# EAGLE design 433MHz-Sender (EAGLE 7.4.0)
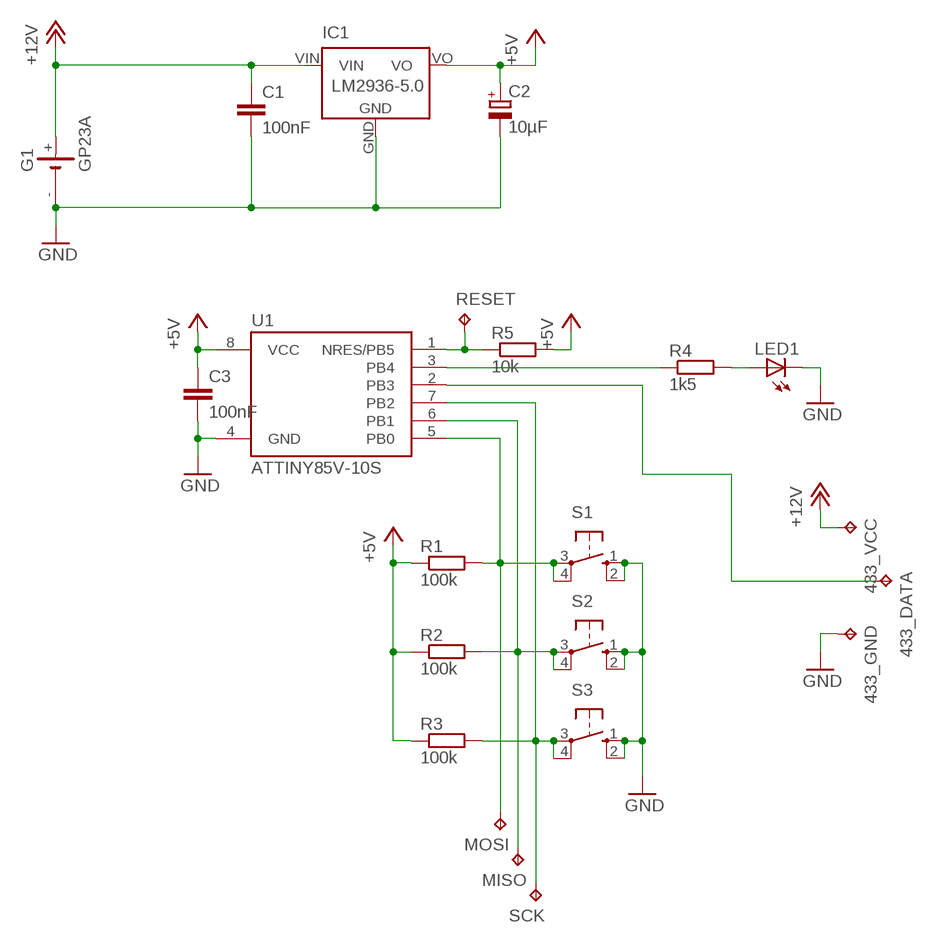
[diagram p0: schematic, sheet 1]

## Parts
433_DATA  TPPAD1-13  [P1-13]
433_GND  TPPAD1-13  [P1-13]
433_VCC  TPPAD1-13  [P1-13]
C1  100nF  C-EU025-025X050  [C025-025X050]
C2  10µF  CPOL-EUE2-4  [E2-4]
C3  100nF  C-EU025-025X050  [C025-025X050]
G1  GP23A  [GP23A]
IC1  LM2936-5.0  [TO92-INLINE]
LED1  LED3MM  [LED3MM]
MISO  TPPAD1-13  [P1-13]
MOSI  TPPAD1-13  [P1-13]
R1  100k  R-EU_0204/5  [0204/5]
R2  100k  R-EU_0204/5  [0204/5]
R3  100k  R-EU_0204/5  [0204/5]
R4  1k5  R-EU_0204/5  [0204/5]
R5  10k  R-EU_0204/5  [0204/5]
RESET  TPPAD1-13  [P1-13]
S1  10-XX  [B3F-10XX]
S2  10-XX  [B3F-10XX]
S3  10-XX  [B3F-10XX]
SCK  TPPAD1-13  [P1-13]
U1  ATTINY85V-10S  [SOIC8_EIAJ_208MIL]

## Nets
+5V: C2.+ C3.1 IC1.VO R1.1 R2.1 R3.1 R5.2 U1.8(VCC)
+12V: 433_VCC.TP C1.1 G1.+ IC1.VIN
GND: 433_GND.TP C1.2 C2.- C3.2 G1.- IC1.GND LED1.K(C) S1.1(S) S1.2(S1) S2.1(S) S2.2(S1) S3.1(S) S3.2(S1) U1.4(GND)
N$1: 433_DATA.TP U1.2(PB3)
N$2: R5.1 RESET.TP U1.1(NRES/PB5)
N$3: MOSI.TP R1.2 S1.3(P) S1.4(P1) U1.5(PB0)
N$4: MISO.TP R2.2 S2.3(P) S2.4(P1) U1.6(PB1)
N$5: R3.2 S3.3(P) S3.4(P1) SCK.TP U1.7(PB2)
N$6: R4.1 U1.3(PB4)
N$7: LED1.A R4.2

## Library data of the parts
433_DATA 433_GND 433_VCC MISO MOSI RESET SCK = testpad:TP: Test pad
C1 C3 = rcl:C-EU: CAPACITOR, European symbol
C2 = rcl:CPOL-EU: POLARIZED CAPACITOR, European symbol
G1 = bat-gp23a:GP23A: LI BATTERY Sonnenschein SL-361 PT
IC1 = LM2936:LM2936?*: Ultra-Low Quiescent Current LDO Voltage Regulator Source: Data sheet <http://www.national.com/ds/LM/LM2936.pdf>
LED1 = led:LED: LED OSRAM: - CHIPLED LG R971, LG N971, LY N971, LG Q971, LY Q971, LO R971, LY R971 LH N974, LH R974 LS Q976, LO Q976, LY Q976 LO Q996 - Hyper CHIPLED LW Q18S LB Q993, LB Q99A, LB R99A - SideLED LS A670, LO A670, LY A670, LG A670, LP A670 LB A673, LV A673, LT A673, LW A673 LH A674 LY A675 LS A676, LA A676, LO A676, LY A676, LW A676 LS A679, LY A679, LG A679 - Hyper Micro SIDELED® LS Y876, LA Y876, LO Y876, LY Y876 LT Y87S - SmartLED LW L88C, LW L88S LB L89C, LB L89S, LG L890 LS L89K, LO L89K, LY L89K LS L896, LA L896, LO L896, LY L896 - TOPLED LS T670, LO T670, LY T670, LG T670, LP T670 LSG T670, LSP T670, LSY T670, LOP T670, LYG T670 LG T671, LOG T671, LSG T671 LB T673, LV T673, LT T673, LW T673 LH T674 LS T676, LA T676, LO T676, LY T676, LB T676, LH T676, LSB T676, LW T676 LB T67C, LV T67C, LT T67C, LS T67K, LO T67K, LY T67K, LW E67C LS E67B, LA E67B, LO E67B, LY E67B, LB E67C, LV E67C, LT E67C LW T67C LS T679, LY T679, LG T679 LS T770, LO T770, LY T770, LG T770, LP T770 LB T773, LV T773, LT T773, LW T773 LH T774 LS E675, LA E675, LY E675, LS T675 LS T776, LA T776, LO T776, LY T776, LB T776 LHGB T686 LT T68C, LB T68C - Hyper Mini TOPLED® LB M676 - Mini TOPLED Santana® LG M470 LS M47K, LO M47K, LY M47K Source: http://www.osram.convergy.de LUXEON: - LUMILED® LXK2-PW12-R00, LXK2-PW12-S00, LXK2-PW14-U00, LXK2-PW14-V00 LXK2-PM12-R00, LXK2-PM12-S00, LXK2-PM14-U00 LXK2-PE12-Q00, LXK2-PE12-R00, LXK2-PE12-S00, LXK2-PE14-T00, LXK2-PE14-U00 LXK2-PB12-K00, LXK2-PB12-L00, LXK2-PB12-M00, LXK2-PB14-N00, LXK2-PB14-P00, LXK2-PB14-Q00 LXK2-PR12-L00, LXK2-PR12-M00, LXK2-PR14-Q00, LXK2-PR14-R00 LXK2-PD12-Q00, LXK2-PD12-R00, LXK2-PD12-S00 LXK2-PH12-R00, LXK2-PH12-S00 LXK2-PL12-P00, LXK2-PL12-Q00, LXK2-PL12-R00 Source: www.luxeon.com KINGBRIGHT: KA-3528ASYC Source: www.kingbright.com
R1-R5 = rcl:R-EU_: RESISTOR, European symbol
S1-S3 = switch-omron:10-XX: OMRON SWITCH; MPN: B3F-1000; OC_FARNELL: 176432; OC_NEWARK: 36M3542
U1 = _hhn_attiny25_45_85:ATTINY85*: ATMEL ATtiny 85 Packages: P = PDIP 08 30mil S = SOIC 08 EIAJ 208mil Technologies Note: for complete ordering code (temp. range, finish, tape&reel etc.) see www.atmel.com • Supply Voltage: V = (1.8…5.5)V | [blank] = (2.7…5.5)V • Speed: 10 = 10 MHz | 20 = 20 MHz Author: Dipl.-Ing. FH Rainer Bayer HHN Hochschule Heilbronn (Heilbronn University), rainer.bayer@hs-heilbronn.de Ingenieurbüro ing-rb, mail@ing-rb.de

## Board
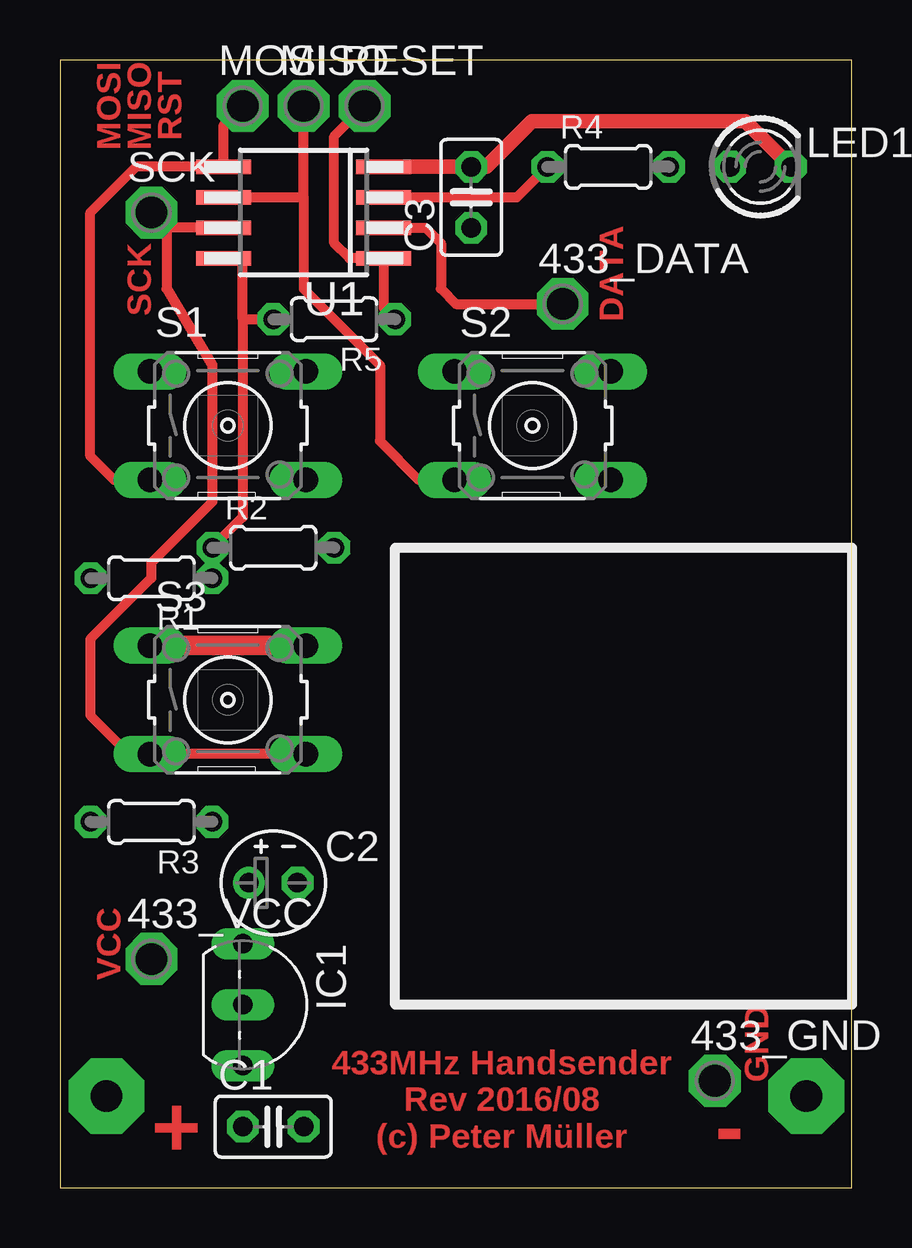
[diagram p1: board, top side]
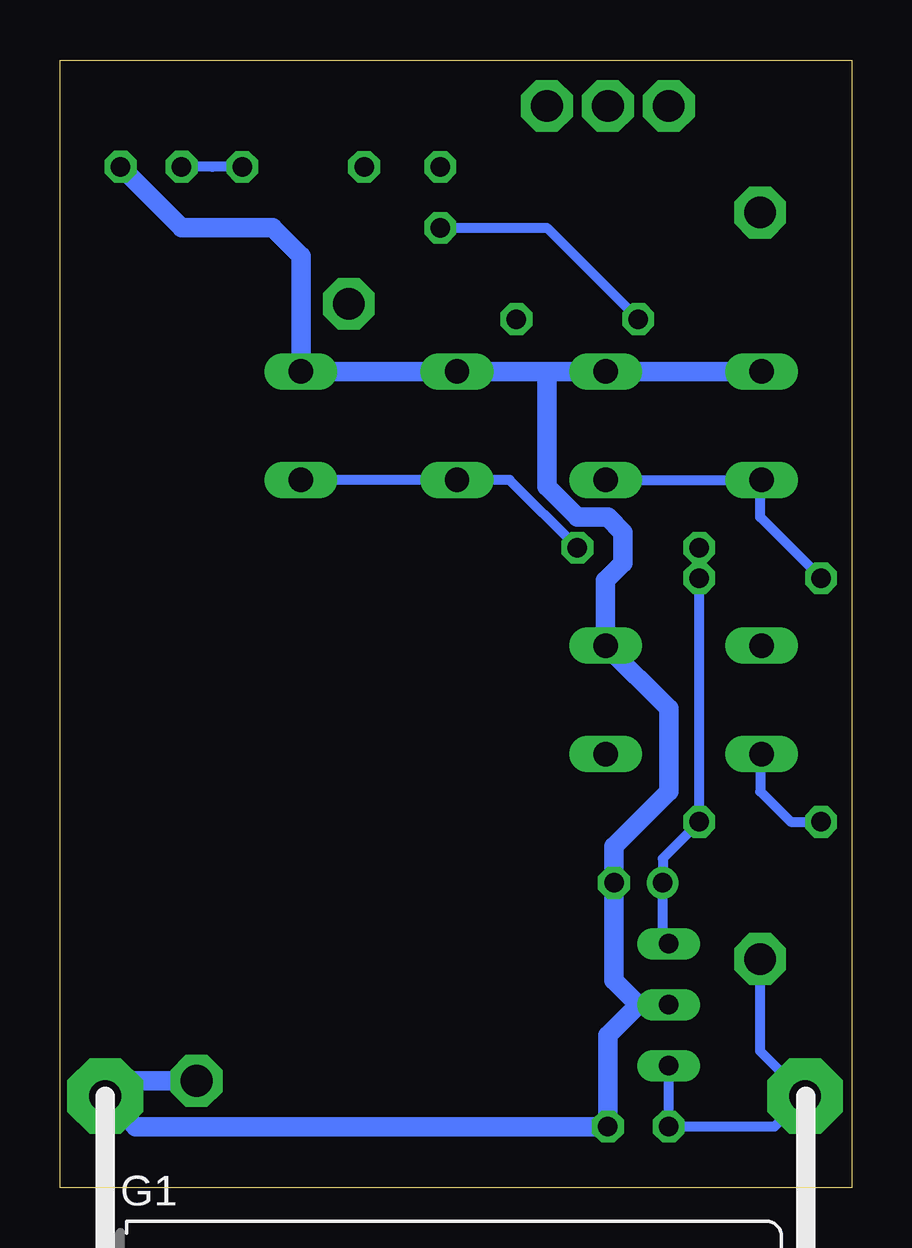
[diagram p2: board, bottom side, seen from below]

Size 33 x 47 mm. Coordinates in mm from the lower left corner, seen from the top.
Outline: 0,0 33,0 33,47 0,47 0,0
Copper layers (1*16): Top 0.035mm / dielectric 1.5mm / Bottom 0.035mm
Design rules "default": minimum track width 10mil, minimum drill 24mil, track to track 8mil, track to pad 8mil, pad to pad 8mil, via to via 8mil, smd to smd 8mil, copper to edge 40mil, drill to drill 8mil, minimum pad ring 10mil, minimum via ring 8mil, stop-mask expansion 4mil, vias tented up to drill 0mil, thermal gap 10mil

### Footprints (pad centres in the part's own frame; a part is rotated, then mirrored left to right if it is on the bottom)
P1-13 = drill 1.321 pad 2.159 octagon: TP 0,0
C025-025X050 = drill 0.813 octagon: 1 -1.27,0; 2 1.27,0
E2-4 = drill 0.813 pad 1.27: + -1.016,0 | drill 0.813 pad 1.27 octagon: - 1.016,0
GP23A = drill 1.321 pad 3.15 octagon: + 13.3,7.62; - -15.875,7.62
TO92-INLINE = drill 0.813 long: GND 0,0; VIN 2.54,0; VO -2.54,0
LED3MM = drill 0.813 octagon: A -1.27,0; K 1.27,0
0204/5 = drill 0.813 octagon: 1 -2.54,0; 2 2.54,0
B3F-10XX = drill 1.016 long: 1 -3.251,2.261; 2 3.251,2.261; 3 -3.251,-2.261; 4 3.251,-2.261
SOIC8_EIAJ_208MIL = smd 0.6 x 2.286: 1 -1.905,-3.33; 2 -0.635,-3.33; 3 0.635,-3.33; 4 1.905,-3.33; 5 1.905,3.33; 6 0.635,3.33; 7 -0.635,3.33; 8 -1.905,3.33

### Placement (x,y rotation side)
433_DATA  20.95,36.83 0 top
433_GND  27.3,4.45 0 top
433_VCC  3.81,9.53 0 top
C1  8.89,2.54 0 top
C2  8.89,12.7 0 top
C3  17.14,41.27 90 top
G1  15.24,-3.81 0 bottom
IC1  7.62,7.62 270 top
LED1  29.2,42.55 0 top
MISO  10.16,45.09 0 top
MOSI  7.62,45.09 0 top
R1  3.81,25.4 180 top
R2  8.89,26.67 0 top
R3  3.81,15.24 180 top
R4  22.86,42.55 0 top
R5  11.43,36.2 180 top
RESET  12.7,45.09 0 top
S1  7,31.76 0 top
S2  19.7,31.76 0 top
S3  7,20.33 0 top
SCK  3.81,40.64 0 top
U1  10.16,40.64 90 top

### Tracks (layer width: path | path; a pad name or v marks a point on that pad's centre or on a via)
+5V
  Top 0.406: 7.62,36.2 7.62,27.94 R2.1 | 7.62,36.2 R5.2 | 7.62,36.2 7.62,38.73 U1.8
  Bottom 0.406: R2.1 R1.1 R3.1 7.87,13.72 C2.+ 7.87,10.41 IC1.VO | C3.1 12.7,40.01 R5.2
+12V
  Bottom 0.406: 433_VCC.TP 3.81,5.68 G1.+ 3.21,2.54 C1.1 IC1.VIN
GND
  Top 0.61: U1.4 C3.2 17.78,42.55 19.68,44.45 28.57,44.45 LED1.K
  Top 0.813: S3.1 S3.2
  Bottom 0.406: 22.86,36.74 22.95,36.83 | C2.- 10.16,12.45
  Bottom 0.813: 12.7,34.02 S1.2 S1.1 | 12.7,34.02 12.7,29.21 11.43,27.94 10.16,27.94 9.53,27.3 9.53,26.04 10.25,25.31 S3.2 7.62,19.96 7.62,16.51 9.91,14.22 C2.- 9.91,8.64 8.89,7.62 | 12.7,34.02 S2.1 S2.2 22.95,36.83 22.95,38.83 24.13,40.01 27.93,40.01 LED1.K | 8.89,7.62 10.16,6.35 C1.2 29.84,2.54 G1.- 30.48,4.45 433_GND.TP | 8.89,7.62 IC1.GND
N$1
  Top 0.406: U1.2 15.24,40.01 15.88,39.37 15.88,37.47 16.51,36.83 433_DATA.TP
N$2
  Top 0.406: R5.1 13.49,36.67 U1.1 12.06,38.73 11.43,39.37 11.43,43.81 RESET.TP
N$3
  Top 0.406: S1.3 2.25,29.5 1.27,30.48 1.27,40.64 3.17,42.55 U1.5 6.83,44.3 MOSI.TP
  Bottom 0.406: R1.2 3.81,27.94 3.81,29.44 S1.3 S1.4
N$4
  Top 0.406: U1.6 10.16,41.27 | 10.16,41.27 10.16,37.47 13.34,34.29 13.34,31.11 14.95,29.5 S2.3 | 10.16,41.27 MISO.TP
  Bottom 0.406: R2.2 14.26,29.5 S2.3 S2.4
N$5
  Top 0.406: 4.45,40.01 SCK.TP | U1.7 4.45,40.01 | 4.45,40.01 4.45,37.47 6.35,34.29 6.35,28.57 3.81,26.04 3.81,25.4 1.27,22.86 1.27,19.68 2.54,18.41 3.4,18.41 S3.3 S3.4
  Bottom 0.406: S3.3 3.81,18.01 3.81,16.51 2.54,15.24 R3.2
N$6
  Top 0.406: U1.3 19.05,41.27 R4.1
N$7
  Bottom 0.406: R4.2 26.66,42.55 LED1.A

### Text on the board
Top: MOSI | MISO | RST | SCK | DATA | VCC | 433MHz Handsender / Rev 2016/08 / (c) Peter Müller | GND | + | -
tDocu: 433MHz Sender